# Altium schematic sheet RPI_CAM_INTERFACE.SchDoc: =project_title
size Tabloid; PageSetup: Record=PageOptions|CenterHorizontal=True|CenterVertical=True|PrintScale=0.71|XCorrection=1.00|YCorrection=1.00|PrintKind=0|BorderSize=5000000|LeftOffset=0|BottomOffset=0|Orientation=2|PaperLength=1000|PaperWidth=1000|Scale=100|PaperSource=7|PrintQuality=-4|MediaType=1|DitherType=10|PrintScaleMode=1|PaperKind=A4; CompanyName: Luxonis Holding; Organization: Luxonis Holding; Address1: 1925 Harmony Park Drive; Address2: Westminster, CO; Address3: 80234; Address4: United States; SheetNumber: 3; SheetTotal: 6
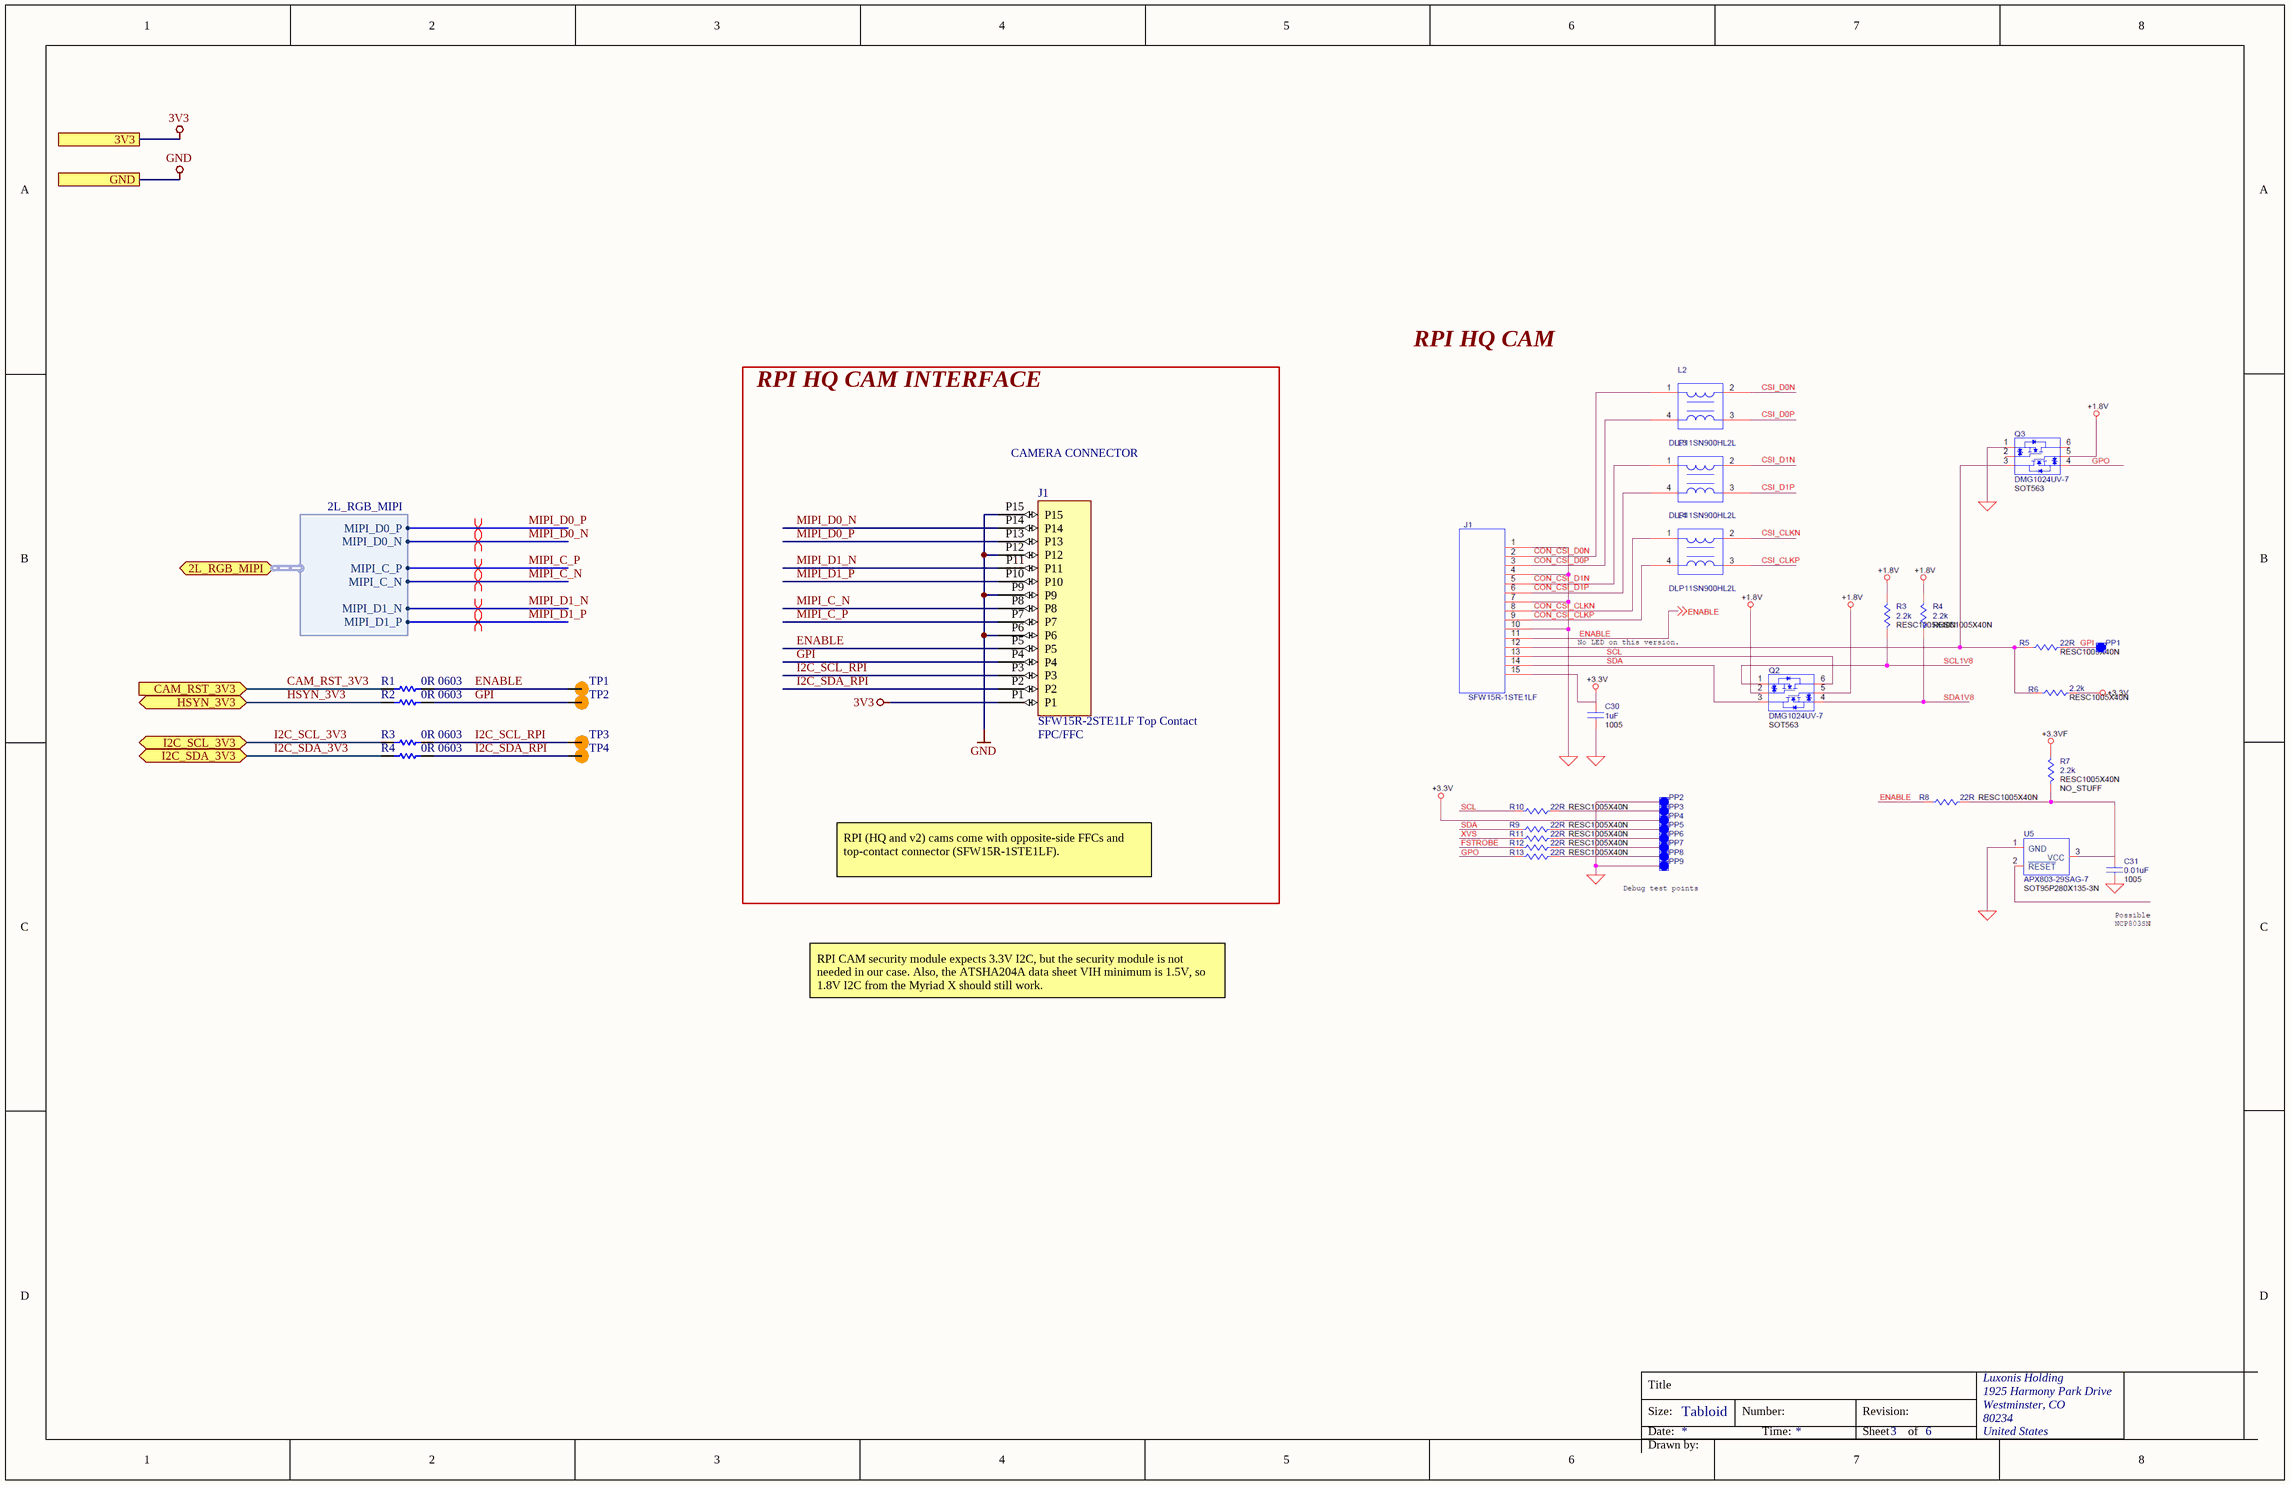
[diagram p0: RPI_CAM_INTERFACE.SchDoc]

## Parts
J1  SFW15R-2STE1LF Top Contact  Component Subtype: FPC/FFC  [SFW15R-2STE1LF]
R1  0R 0603  [RESC0603(1608)_M]
R2  0R 0603  [RESC0603(1608)_M]
R3  0R 0603  [RESC0603(1608)_M]
R4  0R 0603  [RESC0603(1608)_M]
TP1  TP100_150_NS  [TP100_150_NS]  (value not drawn)  (no BOM)
TP2  TP100_150_NS  [TP100_150_NS]  (value not drawn)  (no BOM)
TP3  TP100_150_NS  [TP100_150_NS]  (value not drawn)  (no BOM)
TP4  TP100_150_NS  [TP100_150_NS]  (value not drawn)  (no BOM)

## Blocks framed on the sheet
RPI HQ CAM INTERFACE: J1

## Ports
2L_RGB_MIPI (bidir, harness 2L_RGB_MIPI), 3V3, CAM_RST_3V3 (in), GND, HSYN_3V3 (bidir), I2C_SCL_3V3 (bidir), I2C_SDA_3V3 (bidir)

## Harnesses
2L_RGB_MIPI: MIPI_D0_P, MIPI_D0_N, MIPI_C_P, MIPI_C_N, MIPI_D1_N, MIPI_D1_P

## Nets
3V3: J1.P1 ; port 3V3
GND: J1.P6 J1.P9 J1.P12 J1.P15 ; port GND
CAM_RST_3V3: R1.1 ; port CAM_RST_3V3
ENABLE: J1.P5 R1.2 TP1.1
GPI: J1.P4 R2.2 TP2.1
HSYN_3V3: R2.1 ; port HSYN_3V3
I2C_SCL_3V3: R3.1 ; port I2C_SCL_3V3
I2C_SCL_RPI: J1.P3 R3.2 TP3.1
I2C_SDA_3V3: R4.1 ; port I2C_SDA_3V3
I2C_SDA_RPI: J1.P2 R4.2 TP4.1
MIPI_C_N: J1.P8 ; port 2L_RGB_MIPI.MIPI_C_N
MIPI_C_P: J1.P7 ; port 2L_RGB_MIPI.MIPI_C_P
MIPI_D0_N: J1.P14 ; port 2L_RGB_MIPI.MIPI_D0_N
MIPI_D0_P: J1.P13 ; port 2L_RGB_MIPI.MIPI_D0_P
MIPI_D1_N: J1.P11 ; port 2L_RGB_MIPI.MIPI_D1_N
MIPI_D1_P: J1.P10 ; port 2L_RGB_MIPI.MIPI_D1_P

## Layout directives
differential pair: MIPI_C_N, MIPI_C_P, MIPI_D0_N, MIPI_D0_P, MIPI_D1_N, MIPI_D1_P

## Notes on the sheet
- RPI HQ CAM
- CAMERA CONNECTOR
- RPI (HQ and v2) cams come with opposite-side FFCs and top-contact connector (SFW15R-1STE1LF).
- RPI CAM security module expects 3.3V I2C, but the security module is not needed in our case. Also, the ATSHA204A data sheet VIH minimum is 1.5V, so 1.8V I2C from the Myriad X should still work.
- Title
- Size:
- Date:
- Tabloid
- Number:
- Time:
- Revision:
- Sheet
- of
- Drawn by:

## Library data of the parts
J1 = SFW15R-2STE1LF: CONN FFC FPC TOP 15POS 1MM R/A; Manufacturer: Amphenol; Manufacturer 1: Amphenol FCI; Actuator Material: Glass; Current Rating: 1A; Voltage Rating: 100V; Contact Resistance: 30mR; Number of Positions: 15; Insulation Resistance: 500MR; Wire/Cable Type: Straight; Component Type: Connector; Mount: SMT; Manufacturer PN: SFW15R-2STE1LF; Supplier 1: Digi-Key; Manufacturer Part Number 1: SFW15R-2STE1LF; Stock 1: 4348; Pricing 1: 1=0.51000, 10=0.48200, 25=0.43400, 50=0.38580, 100=0.36960, 250=0.33748, 500=0.32142, 1000=0.26517 (USD); Contact Material: Bronze; Contact Plating: Tin; Housing Color: Brown; Housing Material: Polyphenylene; Min Operating Temperature: -55°C; Max Operating Temperature: 105°C; Packaging: Tape and Reel; Number of Rows: 1; Package Quantity: 2000; Voltage Rating (AC): 100V; Termination: Solder; Contact Location: Top; Number of Contacts: 15; Max Voltage Rating (AC): 100V; Orientation: Right Angle; Length: 20.8mm; Pitch: 1mm; Depth: 6mm; Width: 5.5mm; Lead Free: Lead Free; Flammability Rating: UL94 V-0; ComponentLink1URL: https://datasheet.ciiva.com/670/sfw12lf-670088.pdf?src-supplier=Digi-Key; ComponentLink1Description: https://datasheet.ciiva.com/670/sfw12lf-670088.pdf?src-supplier=Digi-Key; ComponentLink2URL: https://datasheet.ciiva.com/670/sfw12lf-670089.pdf?src-supplier=Digi-Key; ComponentLink2Description: https://datasheet.ciiva.com/670/sfw12lf-670089.pdf?src-supplier=Digi-Key; ComponentLink3URL: https://datasheet.ciiva.com/670/sfw12lf-670090.pdf?src-supplier=Digi-Key; ComponentLink3Description: https://datasheet.ciiva.com/670/sfw12lf-670090.pdf?src-supplier=Digi-Key; ComponentLink4URL: https://datasheet.ciiva.com/5138/sfw12lf-5138988.pdf?src-supplier=Mouser; ComponentLink4Description: https://datasheet.ciiva.com/5138/sfw12lf-5138988.pdf?src-supplier=Mouser; ComponentLink5URL: http://datasheet.octopart.com/SFW15R-2STE1LF-Areva-datasheet-119238.pdf?src-supplier=Mouser; ComponentLink5Description: http://datasheet.octopart.com/SFW15R-2STE1LF-Areva-datasheet-119238.pdf?src-supplier=Mouser; ComponentLink6URL: http://datasheet.octopart.com/SFW15R-2STE1LF-Areva-datasheet-8760026.pdf?src-supplier=_legacy+Avnet; ComponentLink6Description: http://datasheet.octopart.com/SFW15R-2STE1LF-Areva-datasheet-8760026.pdf?src-supplier=_legacy+Avnet; ComponentLink7URL: http://datasheet.octopart.com/SFW15R-2STE1LF-Amphenol-datasheet-94059633.pdf?src-supplier=Newark; ComponentLink7Description: http://datasheet.octopart.com/SFW15R-2STE1LF-Amphenol-datasheet-94059633.pdf?src-supplier=Newark; ComponentLink8URL: http://datasheet.octopart.com/SFW15R-2STE1LF-Amphenol-ICC-datasheet-94059633.pdf?src-supplier=Farnell; ComponentLink8Description: http://datasheet.octopart.com/SFW15R-2STE1LF-Amphenol-ICC-datasheet-94059633.pdf?src-supplier=Farnell; ComponentLink9URL: http://datasheet.octopart.com/SFW15R-2STE1LF-Amphenol-ICC-datasheet-8760026.pdf?src-supplier=Future+Electronics; ComponentLink9Description: http://datasheet.octopart.com/SFW15R-2STE1LF-Amphenol-ICC-datasheet-8760026.pdf?src-supplier=Future+Electronics; Supplier Part Number 1: 609-1906-1-ND; RoHS: Yes; Supplier 2: Digi-Key; Manufacturer 2: Amphenol FCI; Manufacturer Part Number 2: SFW15R-2STE1LF; Stock 2: 4348; Pricing 2: 1=0.51000, 10=0.48200, 25=0.43400, 50=0.38580, 100=0.36960, 250=0.33748, 500=0.32142, 1000=0.26517 (USD); Supplier 3: Mouser; Manufacturer 3: Amphenol FCI; Manufacturer Part Number 3: SFW15R-2STE1LF; Stock 3: 4218; Pricing 3: 1=0.46000, 10=0.35000, 100=0.33600, 500=0.29200, 1000=0.24100, 2000=0.21900, 4000=0.21100, 10000=0.19700, 24000=0.19400 (USD); Supplier Part Number 2: 609-1906-6-ND; Supplier Part Number 3: 649-SFW15R-2STE1LF
R1-R4 = CRCW06030000Z0EA: RES SMD 0 OHM JUMPER 1/10W 0603 0 Ohms Jumper 0.1W, 1/10W Chip Resistor 0603 (1608 Metric) Automotive AEC-Q200 Thick Film; Manufacturer 1: Vishay; Manufacturer Part Number 1: CRCW0603-0000Z0EA; Resistance: 0mR; Power Rating: 100mW; Voltage Rating: 75V; Temperature Coefficient: 100ppm/°C; Tolerance: 5%; Current Rating: 2A; Supplier 1: Digi-Key; Stock 1: 742743; Pricing 1: 1=0.100000, 10=0.034000, 25=0.024400, 50=0.018600, 100=0.013800, 250=0.010480, 500=0.008400, 1000=0.006180 (USD); RoHS: Yes; Mount: Surface Mount; Case/Package: 0603; Weight: 7.1E-05oz; Contact Plating: Tin,Lead; Case Code (Metric): 1608; Case Code (Imperial): 0603; Min Operating Temperature: -55°C; Max Operating Temperature: 155°C; Composition: Thick Film; Termination: SMD/SMT; Packaging: Tape and Reel; Package Quantity: 1; Number of Terminations: 2; Military Standard: Not; Max Power Dissipation: 100mW; Voltage Rating (DC): 75V; Features: Automotive AEC-Q200; Working Voltage: 75V; Length: 1.55mm; Height: 0.02inch; Width: 0.033inch; Depth: 0.85mm; Radiation Hardening: No; Lead Free: Lead Free; REACH SVHC: Unknown; ComponentLink1URL: https://datasheet.ciiva.com/2461/dcrcwe3-2461968.pdf?src-supplier=Digi-Key; ComponentLink1Description: https://datasheet.ciiva.com/2461/dcrcwe3-2461968.pdf?src-supplier=Digi-Key; ComponentLink2URL: https://datasheet.ciiva.com/2461/dcrcwe3-2461969.pdf?src-supplier=Digi-Key; ComponentLink2Description: https://datasheet.ciiva.com/2461/dcrcwe3-2461969.pdf?src-supplier=Digi-Key; ComponentLink3URL: https://datasheet.ciiva.com/2461/dcrcwe3-2461970.pdf?src-supplier=Digi-Key; ComponentLink3Description: https://datasheet.ciiva.com/2461/dcrcwe3-2461970.pdf?src-supplier=Digi-Key; ComponentLink4URL: https://datasheet.ciiva.com/8340/dcrcwe3-8340197.pdf?src-supplier=Avnet; ComponentLink4Description: https://datasheet.ciiva.com/8340/dcrcwe3-8340197.pdf?src-supplier=Avnet; ComponentLink5URL: https://datasheet.ciiva.com/16941/dcrcw-16941302.pdf?src-supplier=Avnet+Europe; ComponentLink5Description: https://datasheet.ciiva.com/16941/dcrcw-16941302.pdf?src-supplier=Avnet+Europe; ComponentLink6URL: https://datasheet.ciiva.com/16199/dcrcwe3-16199063.pdf?src-supplier=Future+Electronics; ComponentLink6Description: https://datasheet.ciiva.com/16199/dcrcwe3-16199063.pdf?src-supplier=Future+Electronics; ComponentLink7URL: https://datasheet.ciiva.com/16725/70201119-16725175.pdf?src-supplier=Allied+Electronics; ComponentLink7Description: https://datasheet.ciiva.com/16725/70201119-16725175.pdf?src-supplier=Allied+Electronics; ComponentLink8URL: https://datasheet.ciiva.com/26316/fld-crcw-e3-data-en-26316615.pdf?src-supplier=Distrelec; ComponentLink8Description: https://datasheet.ciiva.com/26316/fld-crcw-e3-data-en-26316615.pdf?src-supplier=Distrelec; ComponentLink9URL: https://datasheet.ciiva.com/5544/dcrcwe3-109170-5544344.pdf?src-supplier=Mouser; ComponentLink9Description: https://datasheet.ciiva.com/5544/dcrcwe3-109170-5544344.pdf?src-supplier=Mouser; ComponentLink10URL: https://datasheet.ciiva.com/7841/1720486-7841816.pdf?src-supplier=Element14; ComponentLink10Description: https://datasheet.ciiva.com/7841/1720486-7841816.pdf?src-supplier=Element14; ComponentLink11URL: https://datasheet.ciiva.com/7841/1720486-7841817.pdf?src-supplier=Element14; ComponentLink11Description: https://datasheet.ciiva.com/7841/1720486-7841817.pdf?src-supplier=Element14; ComponentLink12URL: https://datasheet.ciiva.com/7841/125364-7841818.pdf?src-supplier=Element14; ComponentLink12Description: https://datasheet.ciiva.com/7841/125364-7841818.pdf?src-supplier=Element14; ComponentLink13URL: https://datasheet.ciiva.com/16721/70201119-16721450.pdf?src-supplier=Allied+Electronics; ComponentLink13Description: https://datasheet.ciiva.com/16721/70201119-16721450.pdf?src-supplier=Allied+Electronics; Supplier Part Number 1: 541-0.0GCT-ND
TP1-TP4 = TEST_POINT